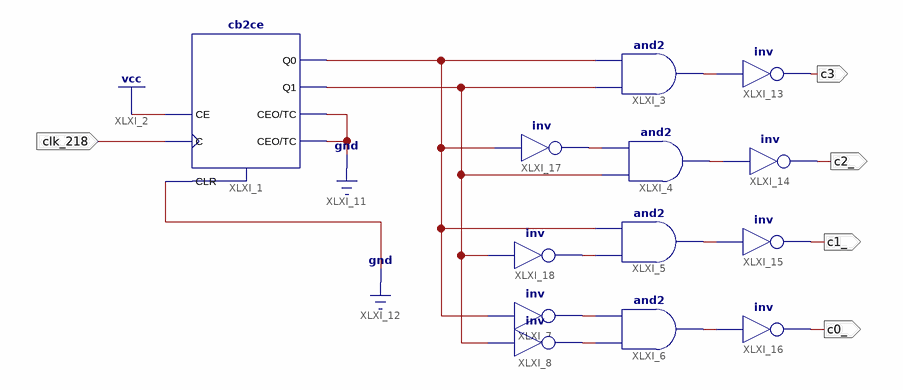
[diagram p0: schematic sheet 1]
// Xilinx ISE schematic commonn.sch (spartan6) as structural Verilog: 13 symbols, 5 ports
module commonn (
  input  clk_218,
  output c3,
  output c2_,
  output c1_,
  output c0_
);

  wire c0, c1, c2, Q0, Q1, XLXN_5, XLXN_6, XLXN_23, XLXN_24, XLXN_25;

  cb2ce XLXI_1 (.C(clk_218), .CE(1'b1), .CLR(1'b0), .CEO(1'b0), .Q0(Q0), .Q1(Q1), .TC(1'b0));
  and XLXI_3 (XLXN_23, Q1, Q0);
  and XLXI_4 (c2, Q1, XLXN_24);
  and XLXI_5 (c1, XLXN_25, Q0);
  and XLXI_6 (c0, XLXN_6, XLXN_5);
  not XLXI_7 (XLXN_5, Q0);
  not XLXI_8 (XLXN_6, Q1);
  not XLXI_13 (c3, XLXN_23);
  not XLXI_14 (c2_, c2);
  not XLXI_15 (c1_, c1);
  not XLXI_16 (c0_, c0);
  not XLXI_17 (XLXN_24, Q0);
  not XLXI_18 (XLXN_25, Q1);
endmodule
